# Altium schematic sheet Flight_Computer.SchDoc
size A4; SheetNumber: 6; SheetTotal: 7
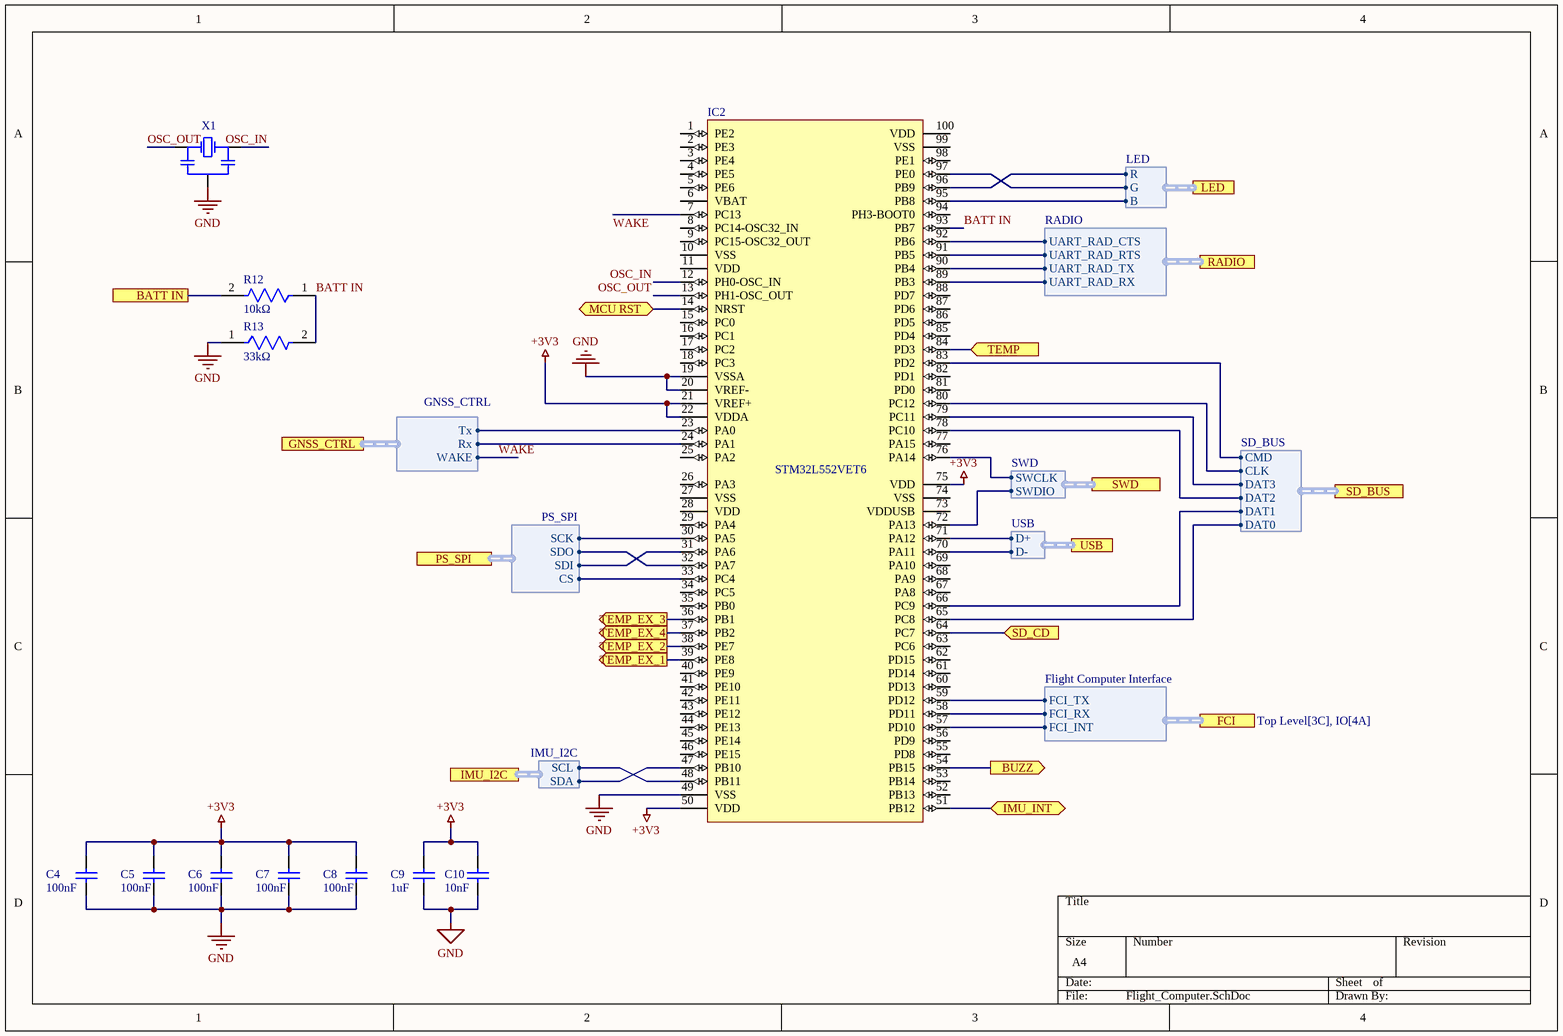
[diagram p0: Flight_Computer.SchDoc]

## Parts
C4  value 100nF  [CAPC1608X10N]  (hidden comment: C0603C104M5RACTU)
C5  value 100nF  [CAPC1608X10N]  (hidden comment: C0603C104M5RACTU)
C6  value 100nF  [CAPC1608X10N]  (hidden comment: C0603C104M5RACTU)
C7  value 100nF  [CAPC1608X10N]  (hidden comment: C0603C104M5RACTU)
C8  value 100nF  [CAPC1608X10N]  (hidden comment: C0603C104M5RACTU)
C9  value 1uF  [CAPC1608X10N]  (hidden comment: C0603C105K8PACTU)
C10  value 10nF  [CAPC1608X10N]  (hidden comment: C0603C103J5RACTU)
IC2  STM32L552VET6  [TSQFP50P1600X1600X160-100N]
R12  10kΩ  [FP-RT0603-MFG]
R13  33kΩ  [FP-CRCW0603-e3-IPC_A]
X1  CSTNE16M0V530000R0  [FP-CSTNE16M0V530000R0-MFG]  (value not drawn)

## Ports
BATT IN (see Top Level[3D], Power[2B]), BUZZ (out, see Top Level[3C], IO[3B]), FCI (harness Flight Computer Interface, see Top Level[3C], IO[4A]), GNSS_CTRL (harness GNSS_CTRL, see Top Level[3D], IO[2B]), IMU_I2C (harness IMU_I2C, see Top Level[2A], Sensors[3C]), IMU_INT (bidir, see Top Level[2B], Sensors[1C]), LED (harness LED, see Top Level[3C], IO[3C]), MCU RST (bidir, see Top Level[3C], IO[2A], IO[2C]), PS_SPI (harness PS_SPI, see Top Level[2A], Sensors[1A]), RADIO (harness RADIO, see Top Level[2D], Radio[3B]), SD_BUS (harness SD_BUS, see Top Level[2C], SD_Card[1B]), SD_CD (in, see Top Level[2B], SD_Card[4B]), SWD (harness SWD, see Top Level[3B], IO[3B]), TEMP (in, see Top Level[2A], Sensors[4A]), TEMP_EX_1 (out, see Top Level[2B], Sensors[4B]), TEMP_EX_2 (out, see Top Level[2B], Sensors[4C]), TEMP_EX_3 (out, see Top Level[2B], Sensors[4B]), TEMP_EX_4 (out, see Top Level[2B], Sensors[4C]), USB (harness USB, see Top Level[3C], IO[1C])

## Harnesses
SD_BUS: CLK, CMD, DAT0, DAT1, DAT2, DAT3
IMU_I2C: SCL, SDA
RADIO: UART_RAD_CTS, UART_RAD_RTS, UART_RAD_TX, UART_RAD_RX
PS_SPI: SCK, SDI, SDO, CS
USB: D+, D-
SWD: SWCLK, SWDIO
LED: B, G, R
GNSS_CTRL: Rx, Tx, WAKE
Flight Computer Interface: FCI_TX, FCI_RX, FCI_INT

## Nets
+3V3: C4.2 C5.2 C6.2 C7.2 C8.2 C9.2 C10.2 IC2.21(VREF+) IC2.22(VDDA) IC2.50(VDD) IC2.75(VDD)
GND: C4.1 C5.1 C6.1 C7.1 C8.1 C9.1 C10.1 IC2.19(VSSA) IC2.20(VREF-) IC2.49(VSS) R13.1 X1.2(GND)
BATT IN: IC2.93(PB7) R12.1 R13.2
BATT IN: R12.2 ; port BATT IN  [a separate net that carries the same name]
BUZZ: IC2.54(PB15) ; port BUZZ
IMU_INT: IC2.51(PB12) ; port IMU_INT
MCU RST: IC2.14(NRST) ; port MCU RST
OSC_IN: IC2.12(PH0-OSC_IN) X1.1(OSC_IN)
OSC_OUT: IC2.13(PH1-OSC_OUT) X1.3(OSC_OUT)
SD_CD: IC2.64(PC7) ; port SD_CD
TEMP: IC2.84(PD3) ; port TEMP
TEMP_EX_1: IC2.39(PE8) ; port TEMP_EX_1
TEMP_EX_2: IC2.38(PE7) ; port TEMP_EX_2
TEMP_EX_3: IC2.36(PB1) ; port TEMP_EX_3
TEMP_EX_4: IC2.37(PB2) ; port TEMP_EX_4
WAKE: IC2.7(PC13) ; port GNSS_CTRL.WAKE
NetIC2_23: IC2.23(PA0) ; port GNSS_CTRL.Tx
NetIC2_24: IC2.24(PA1) ; port GNSS_CTRL.Rx
NetIC2_30: IC2.30(PA5) ; port PS_SPI.SCK
NetIC2_31: IC2.31(PA6) ; port PS_SPI.SDI
NetIC2_32: IC2.32(PA7) ; port PS_SPI.SDO
NetIC2_33: IC2.33(PC4) ; port PS_SPI.CS
NetIC2_47: IC2.47(PB10) ; port IMU_I2C.SDA
NetIC2_48: IC2.48(PB11) ; port IMU_I2C.SCL
NetIC2_57: IC2.57(PD10) ; port FCI.FCI_INT
NetIC2_58: IC2.58(PD11) ; port FCI.FCI_RX
NetIC2_59: IC2.59(PD12) ; port FCI.FCI_TX
NetIC2_65: IC2.65(PC8) ; port SD_BUS.DAT0
NetIC2_66: IC2.66(PC9) ; port SD_BUS.DAT1
NetIC2_70: IC2.70(PA11) ; port USB.D-
NetIC2_71: IC2.71(PA12) ; port USB.D+
NetIC2_72: IC2.72(PA13) ; port SWD.SWDIO
NetIC2_76: IC2.76(PA14) ; port SWD.SWCLK
NetIC2_78: IC2.78(PC10) ; port SD_BUS.DAT2
NetIC2_79: IC2.79(PC11) ; port SD_BUS.DAT3
NetIC2_80: IC2.80(PC12) ; port SD_BUS.CLK
NetIC2_83: IC2.83(PD2) ; port SD_BUS.CMD
NetIC2_89: IC2.89(PB3) ; port RADIO.UART_RAD_RX
NetIC2_90: IC2.90(PB4) ; port RADIO.UART_RAD_TX
NetIC2_91: IC2.91(PB5) ; port RADIO.UART_RAD_RTS
NetIC2_92: IC2.92(PB6) ; port RADIO.UART_RAD_CTS
NetIC2_95: IC2.95(PB8) ; port LED.B
NetIC2_96: IC2.96(PB9) ; port LED.R
NetIC2_97: IC2.97(PE0) ; port LED.G

Not connected (* = marked no-connect by the designer): IC2 1(PE2) 2(PE3) 3(PE4) 4(PE5) 5(PE6) 6(VBAT) 8(PC14-OSC32_IN) 9(PC15-OSC32_OUT) 10(VSS) 11(VDD) 15(PC0) 16(PC1) 17(PC2) 18(PC3) 25(PA2) 26(PA3) 27(VSS) 28(VDD) 29(PA4) 34(PC5) 35(PB0) 40(PE9) 41(PE10) 42(PE11) 43(PE12) 44(PE13) 45(PE14) 46(PE15) 52(PB13) 53(PB14) 55(PD8) 56(PD9) 60(PD13) 61(PD14) 62(PD15) 63(PC6) 67(PA8) 68(PA9) 69(PA10) 73(VDDUSB) 74(VSS) 77(PA15) 81(PD0) 82(PD1) 85(PD4) 86(PD5) 87(PD6) 88(PD7) 94(PH3-BOOT0) 98(PE1) 99(VSS) 100(VDD)

## Library data of the parts
C4-C8 = CMP-00038-5: Cap Ceramic 0.1uF 50V X7R 20% SMD 0603 125C T/R; Dissipation Factor: 2.5%; Min Operating Temperature: -55°C; Contact Plating: Tin,Matte; Height: 0.8mm; Voltage Rating: 50V; REACH SVHC: No SVHC; Max Operating Temperature: 125°C; Termination: SMD/SMT; Package Quantity: 1; Capacitance: 100nF; Packaging: Tape and Reel; Width: 0.031inch; Depth: 0.8mm; Dielectric: X7R; Tolerance: 20%; Lead Pitch: 0.7mm; Thickness: 0.034inch; Length: 1.6mm; Dielectric Material: Ceramic; Radiation Hardening: No; Voltage Rating (DC): 50V; Case/Package: 0603; Case Code (Metric): 1608; Mount: Surface Mount,PCB; Case Code (Imperial): 0603; JLC_PN: C14663
C9 = CMP-00045-2: Cap Ceramic 1uF 10V X5R 10% SMD 0603 85°C Paper T/R; Capacitance: 1uF; Voltage Rating (DC): 10V; Case/Package: 0603; Height: 0.8mm; Tolerance: 10%; Width: 0.031inch; Lead Free: Lead Free; Mount: Surface Mount; Length: 1.6mm; Number of Pins: 2; Radiation Hardening: No; Dielectric: X5R; Voltage: 10V; Depth: 0.8mm; Weight: 7.1E-05oz; REACH SVHC: No SVHC; Package Quantity: 1; Max Operating Temperature: 85°C; Case Code (Imperial): 0603; Thickness: 0.035inch; Min Operating Temperature: -55°C; Dielectric Material: Ceramic; Case Code (Metric): 1608; Packaging: Tape and Reel; Voltage Rating: 10V; Termination: SMD/SMT; JLC_PN: C15849
C10 = CMP-00047-2: Cap Ceramic 0.01uF 50V X7R 5% SMD 0603 125C Paper T/R; Dielectric: X7R; Case/Package: 0603; Height: 0.8mm; Capacitance: 10nF; Depth: 0.8mm; Length: 1.6mm; Min Operating Temperature: -55°C; Radiation Hardening: No; Packaging: Tape and Reel; Max Operating Temperature: 125°C; Mount: Surface Mount; Tolerance: 5%; JLC_PN: C57112
IC2 = CMP-00012-1: STM32L Series 512 kB Flash 256 KB RAM SMT 32-Bit Microcontroller - LQFP-100
R12 = CMP-2000-04608-2: RES SMD 10K OHM 0.5% 1/10W 0603; Manufacturer Part Number: RT0603DRE0710KL; Manufacturer: Yageo; Tolerance: 0.005; Temperature Coefficient: 50 ppm/°C; Voltage Rating: 75V; Power Rating: 0.1W; Temperature Range Low: -55°C; ComponentLink2Description: Datasheet; RoHS: TRUE; Device Class L1: Passive Components; Octopart: https://octopart.com/rt0603dre0710kl-yageo-1185844; Mouser Description: Thin Film Resistors - SMD 10K ohm 0.5% 1/10W; Automotive: No; Device Class L2: Resistors; Device Class L3: Chip SMD Resistors; Footprint Url: http://www.yageo.com/exep/pages/download/literatures/PYu-R_Mount_10.pdf; Temperature Range High: +155°C; Series: RT; Value: 10KΩ; Package: RT0603; Resistance: 10KΩ; Category: Res; Temperature: -55°C to +155°C; Height: 0.55mm; ComponentLink2URL: http://www.yageo.com/documents/recent/PYu-RT_1-to-0.01_RoHS_L_9.pdf; Lead Free: Yes; Composition: Thin Film; Digikey Description: RES SMD 10K OHM 0.5% 1/10W 0603; Ipc Land Pattern Name: RESC16080X45
R13 = CMP-2000-03245-2: RES Thick Film, 33kΩ, 1%, 0.1W, 100ppm/°C, 0603; Voltage Rating: 75V; Resistance: 33kR; Max Power Dissipation: 100mW; Contact Plating: Tin; Min Operating Temperature: -55°C; Radiation Hardening: No; Package Quantity: 10; Tolerance: 1%; Termination: SMD/SMT; Case Code (Metric): 1608; Military Standard: Not; Packaging: Tape and Reel; Case/Package: 0603; Composition: Thick Film; Depth: 0.85mm; Weight: 7.1E-05oz; Max Operating Temperature: 155°C; Height: 0.45mm; Features: Automotive AEC-Q200; Width: 0.033inch; Length: 1.55mm; Power Rating: 100mW; Voltage Rating (DC): 75V; Temperature Coefficient: 100ppm/°C; Case Code (Imperial): 0603; Mount: Surface Mount; Number of Terminations: 2; Lead Free: Lead Free
X1 = CMP-00029-1: CER RES 16.0000MHZ 15PF SMD; Frequency Tolerance: 0.5%; Frequency: 16MHz; Impedance: 40R; Frequency Stability: 0.3%; Capacitance: 15pF; Max Operating Temperature: 85°C; Mount: Surface Mount; Min Operating Temperature: -40°C; Case/Package: SMD/SMT; Packaging: Tape and Reel; Composition: Ceramic